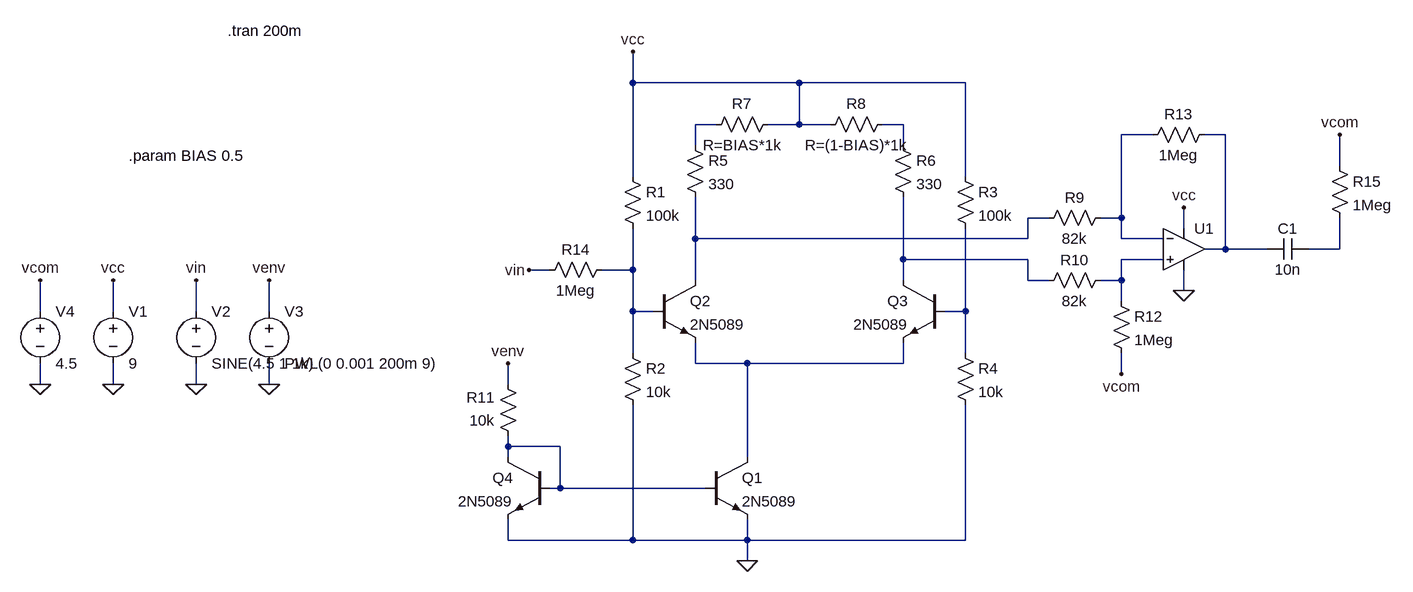
[diagram p0: schematic vca_06.asc]
vca_06.asc, the LTspice schematic file:
Version 4
SHEET 1 2260 680
WIRE 1088 -80 1088 -128
WIRE 1344 -80 1088 -80
WIRE 1600 -80 1344 -80
WIRE 1216 -16 1184 -16
WIRE 1344 -16 1344 -80
WIRE 1344 -16 1296 -16
WIRE 1392 -16 1344 -16
WIRE 1504 -16 1472 -16
WIRE 1888 0 1840 0
WIRE 2000 0 1968 0
WIRE 1184 16 1184 -16
WIRE 1504 16 1504 -16
WIRE 2176 48 2176 0
WIRE 1088 64 1088 -80
WIRE 1600 64 1600 -80
WIRE 1728 128 1696 128
WIRE 1840 128 1840 0
WIRE 1840 128 1808 128
WIRE 1936 144 1936 112
WIRE 1184 160 1184 96
WIRE 1696 160 1696 128
WIRE 1696 160 1184 160
WIRE 1840 160 1840 128
WIRE 1904 160 1840 160
WIRE 2000 176 2000 0
WIRE 2000 176 1968 176
WIRE 2064 176 2000 176
WIRE 2176 176 2176 128
WIRE 2176 176 2128 176
WIRE 1504 192 1504 96
WIRE 1696 192 1504 192
WIRE 1904 192 1840 192
WIRE 960 208 928 208
WIRE 1088 208 1088 144
WIRE 1088 208 1040 208
WIRE 1184 224 1184 160
WIRE 1504 224 1504 192
WIRE 1696 224 1696 192
WIRE 1728 224 1696 224
WIRE 1840 224 1840 192
WIRE 1840 224 1808 224
WIRE 1936 240 1936 208
WIRE 1840 256 1840 224
WIRE 176 272 176 224
WIRE 288 272 288 224
WIRE 416 272 416 224
WIRE 528 272 528 224
WIRE 1088 272 1088 208
WIRE 1120 272 1088 272
WIRE 1600 272 1600 144
WIRE 1600 272 1568 272
WIRE 1088 336 1088 272
WIRE 1600 336 1600 272
WIRE 1184 352 1184 320
WIRE 1264 352 1184 352
WIRE 1504 352 1504 320
WIRE 1504 352 1264 352
WIRE 1840 368 1840 336
WIRE 176 384 176 352
WIRE 288 384 288 352
WIRE 416 384 416 352
WIRE 528 384 528 352
WIRE 896 384 896 352
WIRE 896 480 896 464
WIRE 976 480 896 480
WIRE 896 496 896 480
WIRE 1264 496 1264 352
WIRE 976 544 976 480
WIRE 976 544 960 544
WIRE 1200 544 976 544
WIRE 896 624 896 592
WIRE 1088 624 1088 416
WIRE 1088 624 896 624
WIRE 1264 624 1264 592
WIRE 1264 624 1088 624
WIRE 1600 624 1600 416
WIRE 1600 624 1264 624
WIRE 1264 656 1264 624
FLAG 1088 -128 vcc
FLAG 1264 656 0
FLAG 896 352 venv
FLAG 1936 112 vcc
FLAG 1936 240 0
FLAG 928 208 vin
FLAG 288 384 0
FLAG 416 384 0
FLAG 528 384 0
FLAG 288 224 vcc
FLAG 528 224 venv
FLAG 416 224 vin
FLAG 176 384 0
FLAG 176 224 vcom
FLAG 2176 0 vcom
FLAG 1840 368 vcom
SYMBOL voltage 288 256 R0
SYMATTR InstName V1
SYMATTR Value 9
SYMBOL voltage 416 256 R0
WINDOW 123 0 0 Left 2
WINDOW 39 0 0 Left 2
SYMATTR InstName V2
SYMATTR Value SINE(4.5 1 1k)
SYMBOL voltage 528 256 R0
WINDOW 123 0 0 Left 2
WINDOW 39 0 0 Left 2
SYMATTR InstName V3
SYMATTR Value PWL(0 0.001 200m 9)
SYMBOL npn 1200 496 R0
SYMATTR InstName Q1
SYMATTR Value 2N5089
SYMBOL npn 1120 224 R0
SYMATTR InstName Q2
SYMATTR Value 2N5089
SYMBOL npn 1568 224 M0
SYMATTR InstName Q3
SYMATTR Value 2N5089
SYMBOL npn 960 496 M0
SYMATTR InstName Q4
SYMATTR Value 2N5089
SYMBOL Opamps\\UniversalOpamp2 1936 176 R0
SYMATTR InstName U1
SYMBOL res 1072 48 R0
SYMATTR InstName R1
SYMATTR Value 100k
SYMBOL res 1072 320 R0
SYMATTR InstName R2
SYMATTR Value 10k
SYMBOL res 1584 48 R0
SYMATTR InstName R3
SYMATTR Value 100k
SYMBOL res 1584 320 R0
SYMATTR InstName R4
SYMATTR Value 10k
SYMBOL res 1168 0 R0
SYMATTR InstName R5
SYMATTR Value 330
SYMBOL res 1488 0 R0
SYMATTR InstName R6
SYMATTR Value 330
SYMBOL res 1312 -32 R90
WINDOW 0 0 56 VBottom 2
WINDOW 3 32 56 VTop 2
SYMATTR InstName R7
SYMATTR Value R=BIAS*1k
SYMBOL res 1488 -32 R90
WINDOW 0 0 56 VBottom 2
WINDOW 3 32 56 VTop 2
SYMATTR InstName R8
SYMATTR Value R=(1-BIAS)*1k
SYMBOL res 1824 112 R90
WINDOW 0 0 56 VBottom 2
WINDOW 3 32 56 VTop 2
SYMATTR InstName R9
SYMATTR Value 82k
SYMBOL res 1824 208 R90
WINDOW 0 0 56 VBottom 2
WINDOW 3 32 56 VTop 2
SYMATTR InstName R10
SYMATTR Value 82k
SYMBOL res 912 480 R180
WINDOW 0 36 76 Left 2
WINDOW 3 36 40 Left 2
SYMATTR InstName R11
SYMATTR Value 10k
SYMBOL res 1824 240 R0
SYMATTR InstName R12
SYMATTR Value 1Meg
SYMBOL res 1984 -16 R90
WINDOW 0 0 56 VBottom 2
WINDOW 3 32 56 VTop 2
SYMATTR InstName R13
SYMATTR Value 1Meg
SYMBOL res 1056 192 R90
WINDOW 0 0 56 VBottom 2
WINDOW 3 32 56 VTop 2
SYMATTR InstName R14
SYMATTR Value 1Meg
SYMBOL cap 2128 160 R90
WINDOW 0 0 32 VBottom 2
WINDOW 3 32 32 VTop 2
SYMATTR InstName C1
SYMATTR Value 10n
SYMBOL res 2160 32 R0
SYMATTR InstName R15
SYMATTR Value 1Meg
SYMBOL voltage 176 256 R0
SYMATTR InstName V4
SYMATTR Value 4.5
TEXT 312 32 Left 2 !.param BIAS 0.5
TEXT 464 -160 Left 2 !.tran 200m

The netlist it stands for:
* vca_06.asc
V1 vcc 0 9
V2 vin 0 SINE(4.5 1 1k)
V3 venv 0 PWL(0 0.001 200m 9)
Q1 N011 N012 0 0 2N5089
Q2 N005 N009 N011 0 2N5089
Q3 N007 N010 N011 0 2N5089
Q4 N012 N012 0 0 2N5089
XU1 N008 N003 vcc 0 N004 level.2 Avol=1Meg GBW=10Meg Slew=10Meg ilimit=25m rail=0 Vos=0 phimargin=45 en=0 enk=0 in=0 ink=0 Rin=500Meg  ; pins IN+ IN- V+ V- OUT
R1 vcc N009 100k
R2 N009 0 10k
R3 vcc N010 100k
R4 N010 0 10k
R5 N001 N005 330
R6 N002 N007 330
R7 vcc N001 R=BIAS*1k
R8 N002 vcc R=(1-BIAS)*1k
R9 N003 N005 82k
R10 N008 N007 82k
R11 N012 venv 10k
R12 N008 vcom 1Meg
R13 N004 N003 1Meg
R14 N009 vin 1Meg
C1 N006 N004 10n
R15 vcom N006 1Meg
V4 vcom 0 4.5
.model NPN NPN
.model PNP PNP
.lib standard.bjt
.param BIAS 0.5
.tran 200m
.lib UniversalOpamps2.sub
.backanno
.end